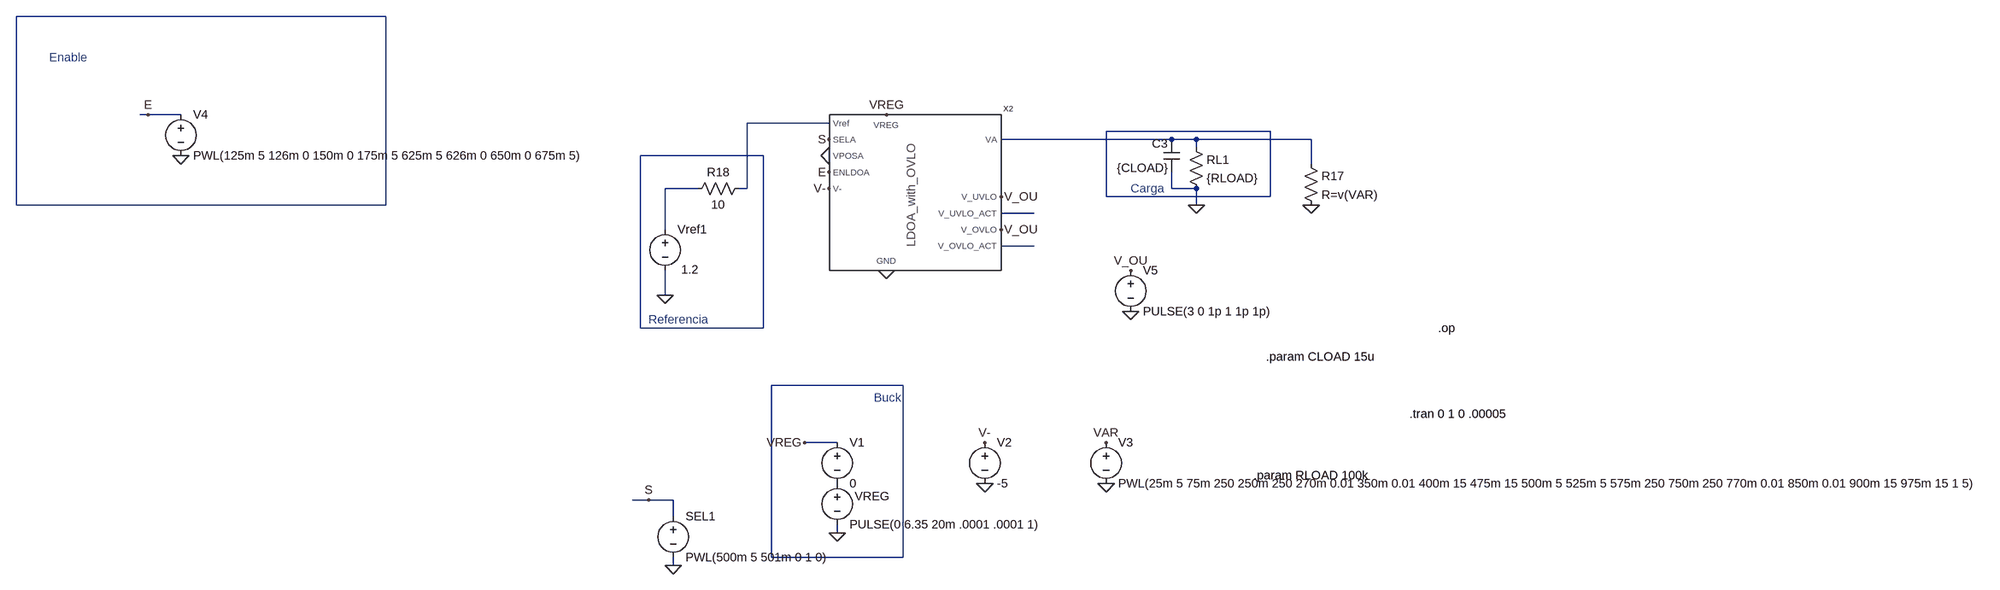
[diagram p0: schematic LDOA_with_OVLO_tran.asc]
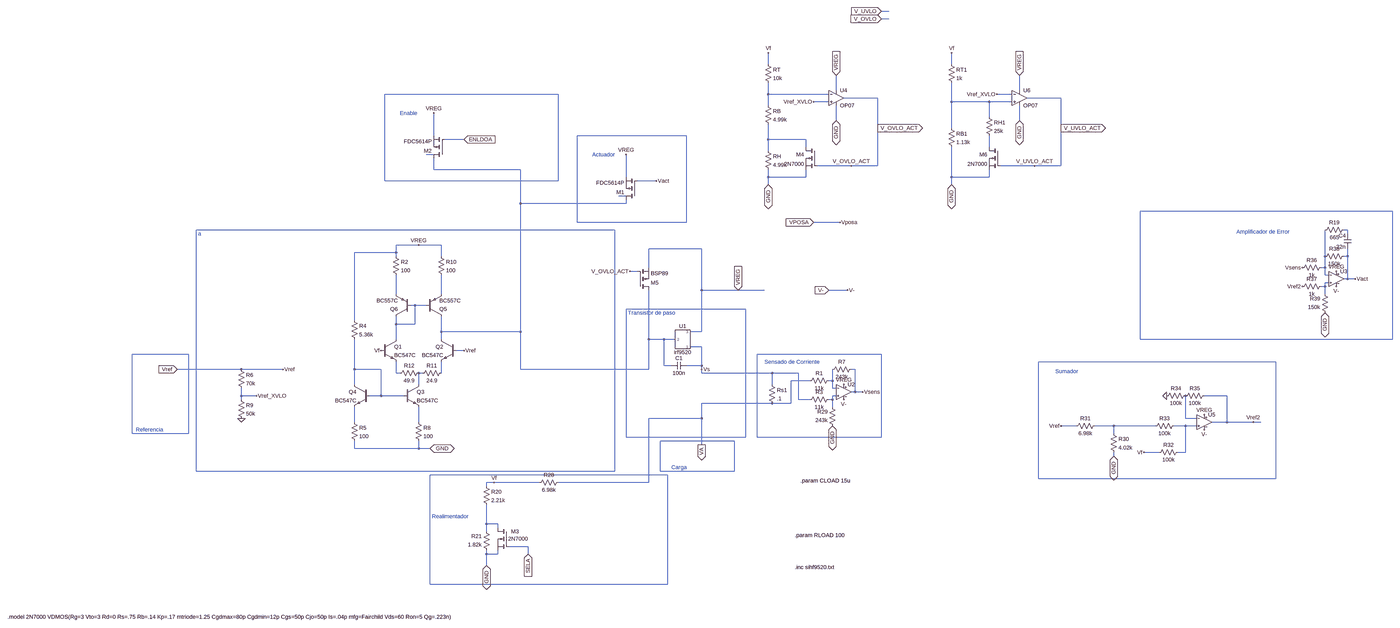
[diagram p1: sub-circuit ldoa_with_ovlo.asc, whole sheet]
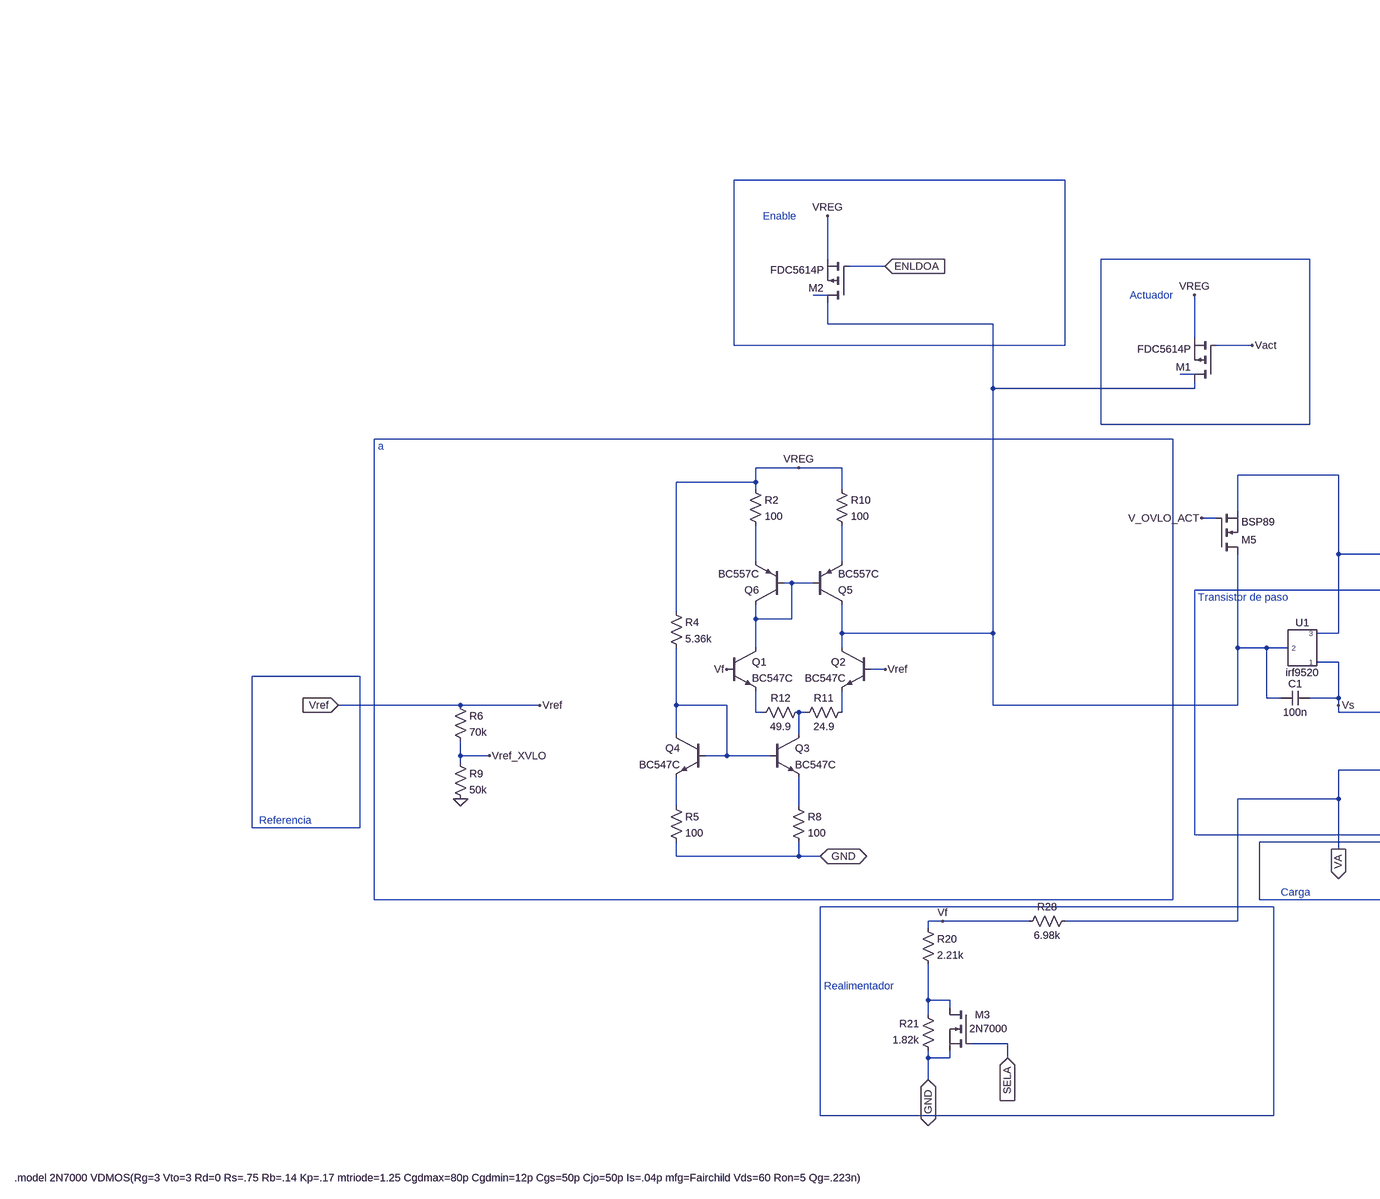
[diagram p2: sub-circuit ldoa_with_ovlo.asc, part, row 1 of 1, column 1 of 2]
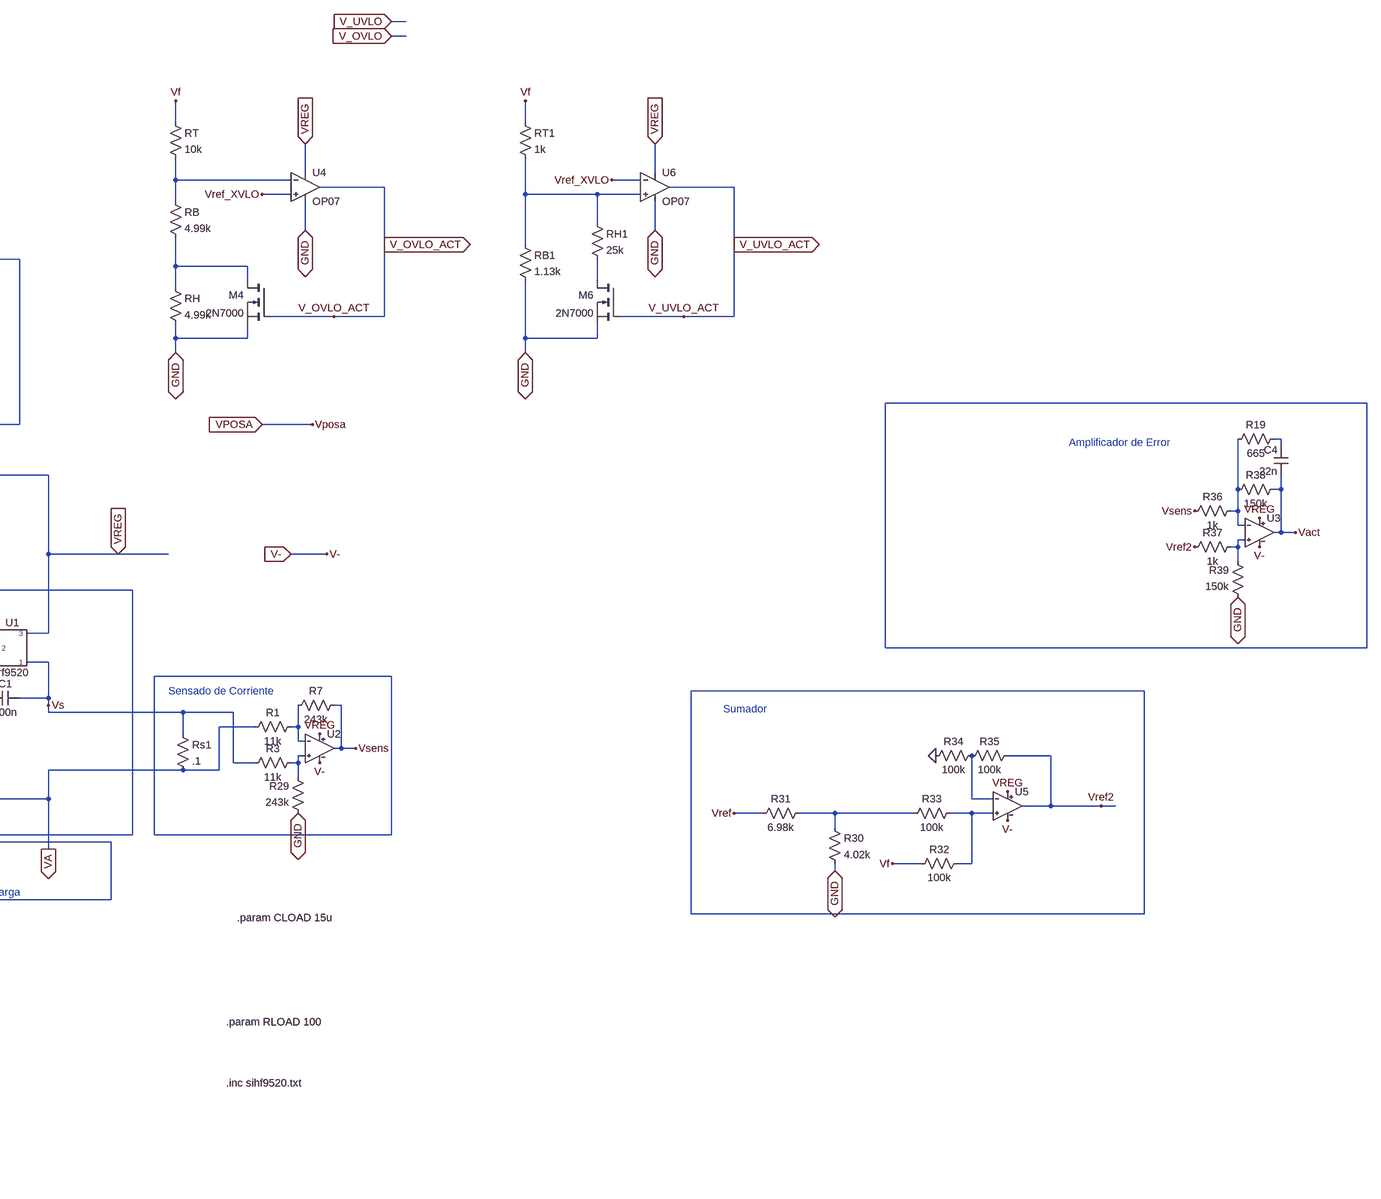
[diagram p3: sub-circuit ldoa_with_ovlo.asc, part, row 1 of 1, column 2 of 2]
LDOA_with_OVLO_tran.asc, the LTspice schematic file:
Version 4
SHEET 1 26844 1652
WIRE 272 -80 -464 -80
WIRE -192 112 -208 112
WIRE -128 112 -192 112
WIRE 1200 128 1040 128
WIRE 2064 144 1744 144
WIRE 1872 160 1536 160
WIRE 1920 160 1872 160
WIRE 2144 160 1920 160
WIRE 1920 176 1920 160
WIRE 1072 192 832 192
WIRE 2144 208 2144 160
WIRE 944 256 880 256
WIRE 1040 256 1040 128
WIRE 1040 256 1024 256
WIRE 1872 256 1872 224
WIRE 1920 256 1872 256
WIRE 1744 272 1744 144
WIRE 2064 272 2064 144
WIRE 2064 272 1744 272
WIRE -464 288 -464 -80
WIRE 272 288 272 -80
WIRE 272 288 -464 288
WIRE 1920 288 1920 256
WIRE 1600 304 1536 304
WIRE 880 336 880 256
WIRE 1600 368 1536 368
WIRE 880 464 880 416
WIRE 832 528 832 192
WIRE 1072 528 1072 192
WIRE 1072 528 832 528
WIRE 1344 640 1088 640
WIRE 1216 752 1152 752
WIRE 848 864 816 864
WIRE 896 864 848 864
WIRE 896 896 896 864
WIRE 1216 928 1216 912
WIRE 1088 976 1088 640
WIRE 1344 976 1344 640
WIRE 1344 976 1088 976
WIRE 896 992 896 976
FLAG 1216 928 0
FLAG 1152 752 VREG
FLAG 896 992 0
FLAG 1504 832 0
FLAG 1504 752 V-
FLAG 1744 832 0
FLAG 1744 752 VAR
FLAG -128 192 0
FLAG 1312 112 VREG
FLAG 1200 256 V-
FLAG 848 864 S
FLAG 1200 160 S
FLAG -192 112 E
FLAG 1200 224 E
FLAG 1920 288 0
FLAG 2144 288 0
FLAG 880 464 0
FLAG 1312 416 0
FLAG 1200 192 0
FLAG 1792 496 0
FLAG 1792 416 V_OU
FLAG 1536 272 V_OU
FLAG 1536 336 V_OU
SYMBOL voltage 1216 816 R0
WINDOW 123 0 0 Left 0
WINDOW 39 0 0 Left 0
WINDOW 0 34 41 Left 2
SYMATTR InstName VREG
SYMATTR Value PULSE(0 6.35 20m .0001 .0001 1)
SYMBOL voltage 1216 736 R0
WINDOW 123 0 0 Left 0
WINDOW 39 0 0 Left 0
SYMATTR InstName V1
SYMATTR Value 0
SYMBOL voltage 896 880 R0
WINDOW 123 0 0 Left 0
WINDOW 39 0 0 Left 0
SYMATTR InstName SEL1
SYMATTR Value PWL(500m 5 501m 0 1 0)
SYMBOL voltage 1504 736 R0
WINDOW 123 0 0 Left 0
WINDOW 39 0 0 Left 0
SYMATTR InstName V2
SYMATTR Value -5
SYMBOL voltage 1744 736 R0
WINDOW 123 0 0 Left 0
WINDOW 39 0 0 Left 0
SYMATTR InstName V3
SYMATTR Value PWL(25m 5 75m 250 250m 250 270m 0.01 350m 0.01 400m 15 475m 15 500m 5 525m 5 575m 250 750m 250 770m 0.01 850m 0.01 900m 15 975m 15 1 5)
SYMBOL voltage -128 96 R0
WINDOW 123 0 0 Left 0
WINDOW 39 0 0 Left 0
SYMATTR InstName V4
SYMATTR Value PWL(125m 5 126m 0 150m 0 175m 5 625m 5 626m 0 650m 0 675m 5)
SYMBOL res 1904 160 R0
SYMATTR InstName RL1
SYMATTR Value {RLOAD}
SYMBOL cap 1888 224 R180
WINDOW 0 24 56 Left 2
WINDOW 3 24 8 Left 2
SYMATTR InstName C3
SYMATTR Value {CLOAD}
SYMBOL res 2128 192 R0
SYMATTR InstName R17
SYMATTR Value R=v(VAR)
SYMBOL voltage 880 320 R0
WINDOW 123 0 0 Left 0
WINDOW 39 0 0 Left 0
WINDOW 3 66 94 Right 2
SYMATTR Value 1.2
SYMATTR InstName Vref1
SYMBOL res 1040 240 R90
WINDOW 0 0 56 VBottom 2
WINDOW 3 32 56 VTop 2
SYMATTR InstName R18
SYMATTR Value 10
SYMBOL LDOA_with_OVLO 1280 192 R0
SYMATTR InstName X2
SYMBOL voltage 1792 400 R0
WINDOW 123 0 0 Left 0
WINDOW 39 0 0 Left 0
SYMATTR InstName V5
SYMATTR Value PULSE(3 0 1p 1 1p 1p)
TEXT 2032 816 Left 2 !.param RLOAD 100k
TEXT 2392 528 Left 2 !.op
TEXT 1288 664 Left 2 ;Buck
TEXT 2056 584 Left 2 !.param CLOAD 15u
TEXT 2336 696 Left 2 !.tran 0 1 0 .00005
TEXT -400 0 Left 2 ;Enable
TEXT 1792 256 Left 2 ;Carga
TEXT 848 512 Left 2 ;Referencia

ldoa_with_ovlo.asc, the sub-circuit schematic file:
Version 4
SHEET 1 26844 1652
WIRE 2432 -1408 2400 -1408
WIRE 2432 -1376 2400 -1376
WIRE 1920 -1184 1920 -1232
WIRE 2704 -1184 2704 -1232
WIRE 2208 -1072 2208 -1136
WIRE 2992 -1072 2992 -1136
WIRE 1024 -1056 288 -1056
WIRE 1920 -1056 1920 -1104
WIRE 2176 -1056 1920 -1056
WIRE 2960 -1056 2896 -1056
WIRE 2384 -1040 2240 -1040
WIRE 3168 -1040 3024 -1040
WIRE 2176 -1024 2112 -1024
WIRE 2704 -1024 2704 -1104
WIRE 2864 -1024 2704 -1024
WIRE 2960 -1024 2864 -1024
WIRE 1920 -1008 1920 -1056
WIRE 2864 -960 2864 -1024
WIRE 2208 -944 2208 -1008
WIRE 2992 -944 2992 -1008
WIRE 2384 -912 2384 -1040
WIRE 2704 -912 2704 -1024
WIRE 3168 -912 3168 -1040
WIRE 496 -880 496 -976
WIRE 1568 -880 1104 -880
WIRE 624 -864 544 -864
WIRE 1920 -864 1920 -928
WIRE 2080 -864 1920 -864
WIRE 2080 -832 2080 -864
WIRE 2864 -832 2864 -880
WIRE 1920 -816 1920 -864
WIRE 496 -800 464 -800
WIRE 2272 -752 2128 -752
WIRE 2384 -752 2384 -912
WIRE 2384 -752 2272 -752
WIRE 3056 -752 2912 -752
WIRE 3168 -752 3168 -912
WIRE 3168 -752 3056 -752
WIRE 496 -736 496 -784
WIRE 864 -736 496 -736
WIRE 1312 -704 1312 -800
WIRE 1920 -704 1920 -736
WIRE 2080 -704 2080 -736
WIRE 2080 -704 1920 -704
WIRE 2704 -704 2704 -832
WIRE 2864 -704 2864 -736
WIRE 2864 -704 2704 -704
WIRE 288 -688 288 -1056
WIRE 1024 -688 1024 -1056
WIRE 1024 -688 288 -688
WIRE 1440 -688 1360 -688
WIRE 1920 -672 1920 -704
WIRE 2704 -672 2704 -704
WIRE 1312 -624 1280 -624
WIRE 864 -592 864 -736
WIRE 1312 -592 1312 -608
WIRE 1312 -592 864 -592
WIRE 4848 -560 3504 -560
WIRE 1104 -512 1104 -880
WIRE 1568 -512 1568 -880
WIRE 1568 -512 1104 -512
WIRE 2224 -512 2112 -512
WIRE 1264 -480 -512 -480
WIRE 4384 -480 4368 -480
WIRE 4384 -464 4384 -480
WIRE 432 -416 336 -416
WIRE 528 -416 432 -416
WIRE 1632 -400 1408 -400
WIRE 336 -384 336 -416
WIRE 336 -384 160 -384
WIRE 336 -368 336 -384
WIRE 528 -368 528 -416
WIRE 4288 -368 4288 -480
WIRE 4384 -368 4384 -400
WIRE 4384 -368 4368 -368
WIRE 1408 -320 1408 -400
WIRE 4288 -320 4288 -368
WIRE 4288 -320 4272 -320
WIRE 1360 -304 1328 -304
WIRE 4288 -288 4288 -320
WIRE 4304 -288 4288 -288
WIRE 4384 -272 4384 -368
WIRE 4384 -272 4368 -272
WIRE 4416 -272 4384 -272
WIRE 4304 -256 4288 -256
WIRE 4288 -240 4288 -256
WIRE 4288 -240 4272 -240
WIRE 1632 -224 1632 -400
WIRE 1792 -224 1632 -224
WIRE 1904 -224 1792 -224
WIRE 2256 -224 2176 -224
WIRE 336 -208 336 -288
WIRE 528 -208 528 -288
WIRE 4288 -208 4288 -240
WIRE 416 -160 400 -160
WIRE 464 -160 416 -160
WIRE 1824 -144 1312 -144
WIRE 160 -96 160 -384
WIRE 336 -80 336 -112
WIRE 416 -80 416 -160
WIRE 416 -80 336 -80
WIRE 528 -48 528 -112
WIRE 864 -48 864 -592
WIRE 864 -48 528 -48
WIRE 1632 -48 1632 -224
WIRE 1632 -48 1584 -48
WIRE 336 -16 336 -80
WIRE 528 -16 528 -48
WIRE 1408 -16 1408 -224
WIRE 1472 -16 1408 -16
WIRE 1520 -16 1472 -16
WIRE 3504 -16 3504 -560
WIRE 4848 -16 4848 -560
WIRE 4848 -16 3504 -16
WIRE 1632 16 1584 16
WIRE 624 32 592 32
WIRE -544 48 -784 48
WIRE 2400 48 1872 48
WIRE 4080 80 3072 80
WIRE 1472 96 1472 -16
WIRE 1504 96 1472 96
WIRE 1632 96 1632 16
WIRE 1632 96 1568 96
WIRE -320 112 -592 112
WIRE -144 112 -320 112
WIRE 160 112 160 -16
WIRE 272 112 160 112
WIRE 864 112 864 -48
WIRE 1408 112 1408 -16
WIRE 1408 112 864 112
WIRE 1632 112 1632 96
WIRE 2288 112 2272 112
WIRE 336 128 336 80
WIRE 352 128 336 128
WIRE 448 128 432 128
WIRE 528 128 528 80
WIRE 1632 128 1632 112
WIRE 1936 128 1632 128
WIRE 2048 128 1936 128
WIRE 2096 160 2016 160
WIRE 2192 160 2192 112
WIRE 2192 160 2176 160
WIRE 160 176 160 112
WIRE 432 176 432 128
WIRE 1936 176 1936 128
WIRE 2192 192 2192 160
WIRE 2208 192 2192 192
WIRE 2288 208 2288 112
WIRE 2288 208 2272 208
WIRE 2320 208 2288 208
WIRE -320 224 -320 192
WIRE -256 224 -320 224
WIRE 272 224 272 112
WIRE 272 224 224 224
WIRE 368 224 272 224
WIRE 2208 224 2192 224
WIRE 3872 224 3776 224
WIRE -320 240 -320 224
WIRE 2048 240 2048 128
WIRE 2096 240 2048 240
WIRE 2192 240 2192 224
WIRE 2192 240 2176 240
WIRE 1936 256 1632 256
WIRE 2016 256 2016 160
WIRE 2016 256 1936 256
WIRE 2192 272 2192 240
WIRE 1632 320 1632 256
WIRE 1632 320 1408 320
WIRE 3696 320 3696 224
WIRE 3744 320 3696 320
WIRE 160 336 160 272
WIRE 432 336 432 272
WIRE 3872 336 3872 224
WIRE 3872 336 3808 336
WIRE 3984 336 3872 336
WIRE 4016 336 3984 336
WIRE 3232 352 3168 352
WIRE 3392 352 3312 352
WIRE 3568 352 3392 352
WIRE 3696 352 3648 352
WIRE 3744 352 3696 352
WIRE -784 384 -784 48
WIRE -544 384 -544 48
WIRE -544 384 -784 384
WIRE 3392 384 3392 352
WIRE 1312 400 1312 -144
WIRE 1824 400 1824 -144
WIRE 1824 400 1312 400
WIRE 1872 400 1872 48
WIRE 2400 400 2400 48
WIRE 2400 400 1872 400
WIRE 1776 416 1456 416
WIRE 1632 432 1632 320
WIRE 160 448 160 416
WIRE 432 448 432 416
WIRE 432 448 160 448
WIRE 480 448 432 448
WIRE 3584 464 3520 464
WIRE 3696 464 3696 352
WIRE 3696 464 3664 464
WIRE 3392 480 3392 464
WIRE -512 544 -512 -480
WIRE 1264 544 1264 -480
WIRE 1264 544 -512 544
WIRE 1456 544 1456 416
WIRE 1776 544 1776 416
WIRE 1776 544 1456 544
WIRE 1488 560 480 560
WIRE 3072 576 3072 80
WIRE 4080 576 4080 80
WIRE 4080 576 3072 576
WIRE 752 592 720 592
WIRE 944 592 752 592
WIRE 1408 592 1408 320
WIRE 1408 592 1024 592
WIRE 720 608 720 592
WIRE 720 768 720 688
WIRE 768 768 720 768
WIRE 768 784 768 768
WIRE 720 800 720 768
WIRE 896 864 816 864
WIRE 720 896 720 880
WIRE 768 896 768 880
WIRE 768 896 720 896
WIRE 896 896 896 864
WIRE 720 944 720 896
WIRE 480 1024 480 560
WIRE 1488 1024 1488 560
WIRE 1488 1024 480 1024
FLAG 1312 -800 VREG
FLAG 1440 -688 Vact
FLAG 1632 112 Vs
FLAG 2320 208 Vsens
FLAG 3984 336 Vref2
FLAG 3168 352 Vref
FLAG 3520 464 Vf
FLAG 3616 224 0
FLAG 4416 -272 Vact
FLAG 4192 -240 Vref2
FLAG 4192 -320 Vsens
FLAG 752 592 Vf
FLAG 432 -416 VREG
FLAG 272 32 Vf
FLAG 2240 176 VREG
FLAG 2256 -224 V-
FLAG 2240 240 V-
FLAG 4336 -304 VREG
FLAG 4336 -240 V-
FLAG 3776 304 VREG
FLAG 3776 368 V-
FLAG 496 -976 VREG
FLAG 624 -864 ENLDOA
IOPIN 624 -864 In
FLAG 1792 -224 VREG
IOPIN 1792 -224 In
FLAG 2176 -224 V-
IOPIN 2176 -224 In
FLAG -592 112 Vref
IOPIN -592 112 In
FLAG 1632 432 VA
IOPIN 1632 432 Out
FLAG 896 896 SELA
IOPIN 896 896 In
FLAG 720 944 GND
IOPIN 720 944 BiDir
FLAG 2192 352 GND
IOPIN 2192 352 BiDir
FLAG 3392 480 GND
IOPIN 3392 480 BiDir
FLAG 4288 -128 GND
IOPIN 4288 -128 BiDir
FLAG 480 448 GND
IOPIN 480 448 BiDir
FLAG 2112 -512 VPOSA
IOPIN 2112 -512 In
FLAG 2224 -512 Vposa
FLAG -144 112 Vref
FLAG 624 32 Vref
FLAG 1920 -672 GND
IOPIN 1920 -672 BiDir
FLAG 2208 -1136 VREG
IOPIN 2208 -1136 In
FLAG 2208 -944 GND
IOPIN 2208 -944 BiDir
FLAG 2400 -1376 V_OVLO
IOPIN 2400 -1376 In
FLAG 2384 -912 V_OVLO_ACT
IOPIN 2384 -912 Out
FLAG 2272 -752 V_OVLO_ACT
FLAG 1328 -304 V_OVLO_ACT
FLAG 2704 -672 GND
IOPIN 2704 -672 BiDir
FLAG 2992 -1136 VREG
IOPIN 2992 -1136 In
FLAG 2992 -944 GND
IOPIN 2992 -944 BiDir
FLAG 2400 -1408 V_UVLO
IOPIN 2400 -1408 In
FLAG 3168 -912 V_UVLO_ACT
IOPIN 3168 -912 Out
FLAG 3056 -752 V_UVLO_ACT
FLAG 1920 -1232 Vf
FLAG 2704 -1232 Vf
FLAG 2112 -1024 Vref_XVLO
FLAG 2896 -1056 Vref_XVLO
FLAG -320 320 0
FLAG -256 224 Vref_XVLO
SYMBOL pmos 1360 -608 R180
SYMATTR InstName M1
SYMATTR Value FDC5614P
SYMBOL cap 1568 80 R90
WINDOW 0 0 32 VBottom 2
WINDOW 3 32 32 VTop 2
SYMATTR InstName C1
SYMATTR Value 100n
SYMBOL res 4272 -464 R270
WINDOW 0 32 56 VTop 2
WINDOW 3 0 56 VBottom 2
SYMATTR InstName R19
SYMATTR Value 665
SYMBOL cap 4400 -400 R180
WINDOW 0 24 56 Left 2
WINDOW 3 24 8 Left 2
SYMATTR InstName C4
SYMATTR Value 22n
SYMBOL res 704 592 R0
SYMATTR InstName R20
SYMATTR Value 2.21k
SYMBOL res 736 896 R180
WINDOW 0 36 76 Left 2
WINDOW 3 36 40 Left 2
SYMATTR InstName R21
SYMATTR Value 1.82k
SYMBOL res 1040 576 R90
WINDOW 0 0 56 VBottom 2
WINDOW 3 32 56 VTop 2
SYMATTR InstName R28
SYMATTR Value 6.98k
SYMBOL nmos 816 784 M0
WINDOW 0 -42 16 Left 2
WINDOW 3 -80 47 Left 2
SYMATTR InstName M3
SYMATTR Value 2N7000
SYMBOL res 1920 160 R0
SYMATTR InstName Rs1
SYMATTR Value .1
SYMBOL res 2192 144 R90
WINDOW 0 0 56 VBottom 2
WINDOW 3 32 56 VTop 2
SYMATTR InstName R1
SYMATTR Value 11k
SYMBOL res 2192 224 R90
WINDOW 0 0 56 VBottom 2
WINDOW 3 32 56 VTop 2
SYMATTR InstName R3
SYMATTR Value 11k
SYMBOL res 2288 96 R90
WINDOW 0 0 56 VBottom 2
WINDOW 3 32 56 VTop 2
SYMATTR InstName R7
SYMATTR Value 243k
SYMBOL res 2208 368 R180
WINDOW 0 36 76 Left 2
WINDOW 3 36 40 Left 2
SYMATTR InstName R29
SYMATTR Value 243k
SYMBOL res 3376 368 R0
SYMATTR InstName R30
SYMATTR Value 4.02k
SYMBOL res 3328 336 R90
WINDOW 0 0 56 VBottom 2
WINDOW 3 32 56 VTop 2
SYMATTR InstName R31
SYMATTR Value 6.98k
SYMBOL res 3680 448 R90
WINDOW 0 0 56 VBottom 2
WINDOW 3 32 56 VTop 2
SYMATTR InstName R32
SYMATTR Value 100k
SYMBOL res 3664 336 R90
WINDOW 0 0 56 VBottom 2
WINDOW 3 32 56 VTop 2
SYMATTR InstName R33
SYMATTR Value 100k
SYMBOL res 3712 208 R90
WINDOW 0 0 56 VBottom 2
WINDOW 3 32 56 VTop 2
SYMATTR InstName R34
SYMATTR Value 100k
SYMBOL res 3792 208 R90
WINDOW 0 0 56 VBottom 2
WINDOW 3 32 56 VTop 2
SYMATTR InstName R35
SYMATTR Value 100k
SYMBOL res 4288 -336 R90
WINDOW 0 0 56 VBottom 2
WINDOW 3 32 56 VTop 2
SYMATTR InstName R36
SYMATTR Value 1k
SYMBOL res 4288 -256 R90
WINDOW 0 0 56 VBottom 2
WINDOW 3 32 56 VTop 2
SYMATTR InstName R37
SYMATTR Value 1k
SYMBOL res 4384 -384 R90
WINDOW 0 0 56 VBottom 2
WINDOW 3 32 56 VTop 2
SYMATTR InstName R38
SYMATTR Value 150k
SYMBOL res 4304 -112 R180
WINDOW 0 36 76 Left 2
WINDOW 3 36 40 Left 2
SYMATTR InstName R39
SYMATTR Value 150k
SYMBOL npn 272 -16 R0
SYMATTR InstName Q1
SYMATTR Value BC547C
SYMBOL npn 592 -16 M0
SYMATTR InstName Q2
SYMATTR Value BC547C
SYMBOL res 320 -384 R0
SYMATTR InstName R2
SYMATTR Value 100
SYMBOL npn 368 176 R0
SYMATTR InstName Q3
SYMATTR Value BC547C
SYMBOL npn 224 176 M0
SYMATTR InstName Q4
SYMATTR Value BC547C
SYMBOL res 144 -112 R0
SYMATTR InstName R4
SYMATTR Value 5.36k
SYMBOL res 144 320 R0
SYMATTR InstName R5
SYMATTR Value 100
SYMBOL res 416 320 R0
SYMATTR InstName R8
SYMATTR Value 100
SYMBOL res 512 -384 R0
SYMATTR InstName R10
SYMATTR Value 100
SYMBOL pnp 464 -112 M180
SYMATTR InstName Q5
SYMATTR Value BC557C
SYMBOL pnp 400 -112 R180
SYMATTR InstName Q6
SYMATTR Value BC557C
SYMBOL res 544 112 R90
WINDOW 0 0 56 VBottom 2
WINDOW 3 32 56 VTop 2
SYMATTR InstName R11
SYMATTR Value 24.9
SYMBOL res 448 112 R90
WINDOW 0 0 56 VBottom 2
WINDOW 3 32 56 VTop 2
SYMATTR InstName R12
SYMATTR Value 49.9
SYMBOL TL081 2240 208 R0
SYMATTR InstName U2
SYMBOL TL081 4336 -272 R0
SYMATTR InstName U3
SYMBOL TL081 3776 336 R0
SYMATTR InstName U5
SYMBOL pmos 544 -784 R180
SYMATTR InstName M2
SYMATTR Value FDC5614P
SYMBOL res 1904 -1200 R0
SYMATTR InstName RT
SYMATTR Value 10k
SYMBOL res 1904 -1024 R0
SYMATTR InstName RB
SYMATTR Value 4.99k
SYMBOL res 1904 -832 R0
SYMATTR InstName RH
SYMATTR Value 4.99k
SYMBOL nmos 2128 -832 M0
SYMATTR InstName M4
SYMATTR Value 2N7000
SYMBOL OpAmps\\OP07 2208 -1104 R0
SYMATTR InstName U4
SYMBOL res 2688 -1200 R0
SYMATTR InstName RT1
SYMATTR Value 1k
SYMBOL res 2688 -928 R0
SYMATTR InstName RB1
SYMATTR Value 1.13k
SYMBOL res 2848 -976 R0
SYMATTR InstName RH1
SYMATTR Value 25k
SYMBOL nmos 2912 -832 M0
SYMATTR InstName M6
SYMATTR Value 2N7000
SYMBOL OpAmps\\OP07 2992 -1104 R0
SYMATTR InstName U6
SYMBOL res -336 96 R0
SYMATTR InstName R6
SYMATTR Value 70k
SYMBOL res -336 224 R0
SYMATTR InstName R9
SYMATTR Value 50k
SYMBOL nmos 1360 -224 M180
SYMATTR InstName M5
SYMATTR Value BSP89
SYMBOL irf9520 1552 -16 R0
SYMATTR InstName U1
TEXT -768 368 Left 2 ;Referencia
TEXT 488 736 Left 2 ;Realimentador
TEXT -504 -464 Left 2 ;a
TEXT 1320 -128 Left 2 ;Transistor de paso
TEXT 1504 528 Left 2 ;Carga
TEXT 2032 816 Left 2 !.param RLOAD 100
TEXT 2032 952 Left 2 !.inc sihf9520.txt
TEXT -1312 1168 Left 2 !.model 2N7000 VDMOS(Rg=3 Vto=3 Rd=0 Rs=.75 Rb=.14 Kp=.17 mtriode=1.25 Cgdmax=80p Cgdmin=12p Cgs=50p Cjo=50p Is=.04p mfg=Fairchild Vds=60 Ron=5 Qg=.223n)
TEXT 1168 -800 Left 2 ;Actuador
TEXT 3912 -472 Left 2 ;Amplificador de Error
TEXT 2056 584 Left 2 !.param CLOAD 15u
TEXT 3144 120 Left 2 ;Sumador
TEXT 1904 80 Left 2 ;Sensado de Corriente
TEXT 352 -976 Left 2 ;Enable

The netlist it stands for:
* LDOA_with_OVLO_tran.asc
VREG P001 0 PULSE(0 6.35 20m .0001 .0001 1)
V1 VREG P001 0
V§SEL1 S 0 PWL(500m 5 501m 0 1 0)
V2 V- 0 -5
V3 VAR 0 PWL(25m 5 75m 250 250m 250 270m 0.01 350m 0.01 400m 15 475m 15 500m 5 525m 5 575m 250 750m 250 770m 0.01 850m 0.01 900m 15 975m 15 1 5)
V4 E 0 PWL(125m 5 126m 0 150m 0 175m 5 625m 5 626m 0 650m 0 675m 5)
RL1 N004 0 {RLOAD}
C3 0 N004 {CLOAD}
R17 N004 0 R=v(VAR)
Vref1 N006 0 1.2
R18 N002 N006 10
XX2 0 VREG E N002 V- 0 S N004 V_OU N008 V_OU N007 ldoa_with_ovlo
V5 V_OU 0 PULSE(3 0 1p 1 1p 1p)

* block symbol definitions
.subckt ldoa_with_ovlo GND VREG ENLDOA Vref V- VPOSA SELA VA V_OVLO V_OVLO_ACT V_UVLO V_UVLO_ACT
M1 N008 Vact VREG VREG FDC5614P
C1 Vs N008 100n
R19 N013 N012 665
C4 Vact N012 22n
R20 Vf N035 2.21k
R21 GND N035 1.82k
R28 VA Vf 6.98k
M3 N035 SELA GND GND 2N7000
Rs1 Vs VA .1
R1 N026 VA 11k
R3 N027 Vs 11k
R7 Vsens N026 243k
R29 GND N027 243k
R30 N031 GND 4.02k
R31 N031 Vref 6.98k
R32 N032 Vf 100k
R33 N032 N031 100k
R34 N028 0 100k
R35 Vref2 N028 100k
R36 N013 Vsens 1k
R37 N014 Vref2 1k
R38 Vact N013 150k
R39 GND N014 150k
Q1 N017 Vf N023 0 BC547C
Q2 N008 Vref N025 0 BC547C
R2 VREG N015 100
Q3 N024 N022 N030 0 BC547C
Q4 N022 N022 N029 0 BC547C
R4 VREG N022 5.36k
R5 N029 GND 100
R8 N030 GND 100
R10 VREG N016 100
Q5 N008 N017 N016 0 BC557C
Q6 N017 N017 N015 0 BC557C
R11 N025 N024 24.9
R12 N024 N023 49.9
XU2 N027 N026 VREG V- Vsens TL081  ; pins In+ In- V+ V- OUT
XU3 N014 N013 VREG V- Vact TL081  ; pins In+ In- V+ V- OUT
XU5 N032 N028 VREG V- Vref2 TL081  ; pins In+ In- V+ V- OUT
M2 N008 ENLDOA VREG VREG FDC5614P
RT Vf N002 10k
RB N002 N005 4.99k
RH N005 GND 4.99k
M4 N005 V_OVLO_ACT GND GND 2N7000
XU4 Vref_XVLO N002 VREG GND V_OVLO_ACT LT1001  ; OP07, pins In+ In- V+ V- OUT
RT1 Vf N003 1k
RB1 N003 GND 1.13k
RH1 N003 N006 25k
M6 N006 V_UVLO_ACT GND GND 2N7000
XU6 N003 Vref_XVLO VREG GND V_UVLO_ACT LT1001  ; OP07, pins In+ In- V+ V- OUT
R6 Vref Vref_XVLO 70k
R9 Vref_XVLO 0 50k
M5 N008 V_OVLO_ACT VREG VREG BSP89
XU1 Vs N008 VREG irf9520  ; pins 1 2 3
* Referencia
* Realimentador
* a
* Transistor de paso
* Carga
.param RLOAD 100
.inc sihf9520.txt
.model 2N7000 VDMOS(Rg=3 Vto=3 Rd=0 Rs=.75 Rb=.14 Kp=.17 mtriode=1.25 Cgdmax=80p Cgdmin=12p Cgs=50p Cjo=50p Is=.04p mfg=Fairchild Vds=60 Ron=5 Qg=.223n)
* Actuador
* Amplificador de Error
.param CLOAD 15u
* Sumador
* Sensado de Corriente
* Enable
.ends ldoa_with_ovlo

.model NPN NPN
.model PNP PNP
.lib standard.bjt
.model NMOS NMOS
.model PMOS PMOS
.lib standard.mos
.param RLOAD 100k
.op
* Buck
.param CLOAD 15u
.tran 0 1 0 .00005
* Enable
* Carga
* Referencia
.lib TL081.301
.lib LTC.lib
.lib sihf9520.txt
.backanno
.end